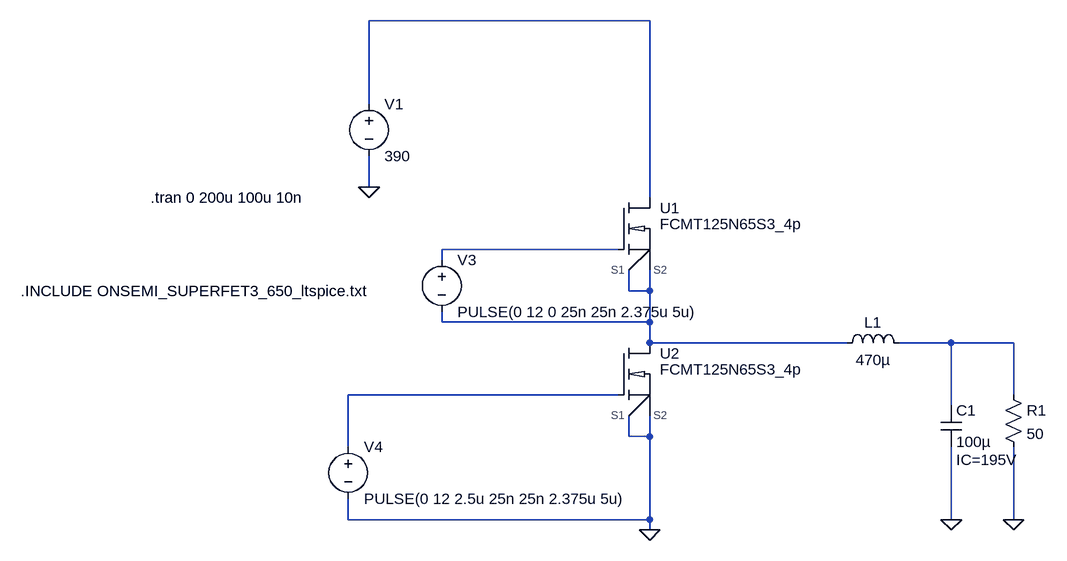
[diagram p0: schematic HB_TEST.asc]
HB_TEST.asc, the LTspice schematic file:
Version 4
SHEET 1 880 680
WIRE 240 -256 -192 -256
WIRE -192 -128 -192 -256
WIRE -192 0 -192 -48
WIRE 240 16 240 -256
WIRE 192 96 -80 96
WIRE -80 112 -80 96
WIRE 208 160 208 128
WIRE 240 160 240 128
WIRE 240 160 208 160
WIRE -80 208 -80 192
WIRE 240 208 240 160
WIRE 240 208 -80 208
WIRE 240 240 240 208
WIRE 544 240 240 240
WIRE 704 240 624 240
WIRE 800 240 704 240
WIRE 192 320 -224 320
WIRE 800 320 800 240
WIRE 704 336 704 240
WIRE 208 384 208 352
WIRE 240 384 240 352
WIRE 240 384 208 384
WIRE -224 400 -224 320
WIRE -224 512 -224 480
WIRE 240 512 240 384
WIRE 240 512 -224 512
WIRE 704 512 704 400
WIRE 800 512 800 400
WIRE 240 528 240 512
FLAG 240 528 0
FLAG -192 0 0
FLAG 704 512 0
FLAG 800 512 0
SYMBOL Onsemi\\FCMT125N65S3_4p 192 16 R0
SYMATTR InstName U1
SYMBOL Onsemi\\FCMT125N65S3_4p 192 240 R0
SYMATTR InstName U2
SYMBOL voltage -80 96 R0
WINDOW 123 0 0 Left 0
WINDOW 39 0 0 Left 0
SYMATTR InstName V3
SYMATTR Value PULSE(0 12 0 25n 25n 2.375u 5u)
SYMBOL voltage -224 384 R0
WINDOW 123 0 0 Left 0
WINDOW 39 0 0 Left 0
SYMATTR InstName V4
SYMATTR Value PULSE(0 12 2.5u 25n 25n 2.375u 5u)
SYMBOL voltage -192 -144 R0
WINDOW 123 0 0 Left 0
WINDOW 39 0 0 Left 0
SYMATTR InstName V1
SYMATTR Value 390
SYMBOL ind 528 256 R270
WINDOW 0 32 56 VTop 2
WINDOW 3 5 56 VBottom 2
SYMATTR InstName L1
SYMATTR Value 470µ
SYMBOL res 784 304 R0
SYMATTR InstName R1
SYMATTR Value 50
SYMBOL cap 688 336 R0
WINDOW 39 24 84 Left 2
SYMATTR InstName C1
SYMATTR Value 100µ
SYMATTR SpiceLine IC=195V
TEXT -728 160 Left 2 !.INCLUDE ONSEMI_SUPERFET3_650_ltspice.txt
TEXT -528 16 Left 2 !.tran 0 200u 100u 10n

The netlist it stands for:
* HB_TEST.asc
XU1 N001 N002 N003 N003 FCMT125N65S3_4p  ; pins D G S1 S2
XU2 N003 N005 0 0 FCMT125N65S3_4p  ; pins D G S1 S2
V3 N002 N003 PULSE(0 12 0 25n 25n 2.375u 5u)
V4 N005 0 PULSE(0 12 2.5u 25n 25n 2.375u 5u)
V1 N001 0 390
L1 N003 N004 470µ
R1 N004 0 50
C1 N004 0 100µ IC=195V
.INCLUDE ONSEMI_SUPERFET3_650_ltspice.txt
.tran 0 200u 100u 10n
.backanno
.end